# EAGLE design tsop_pcb (EAGLE 9.6.2)
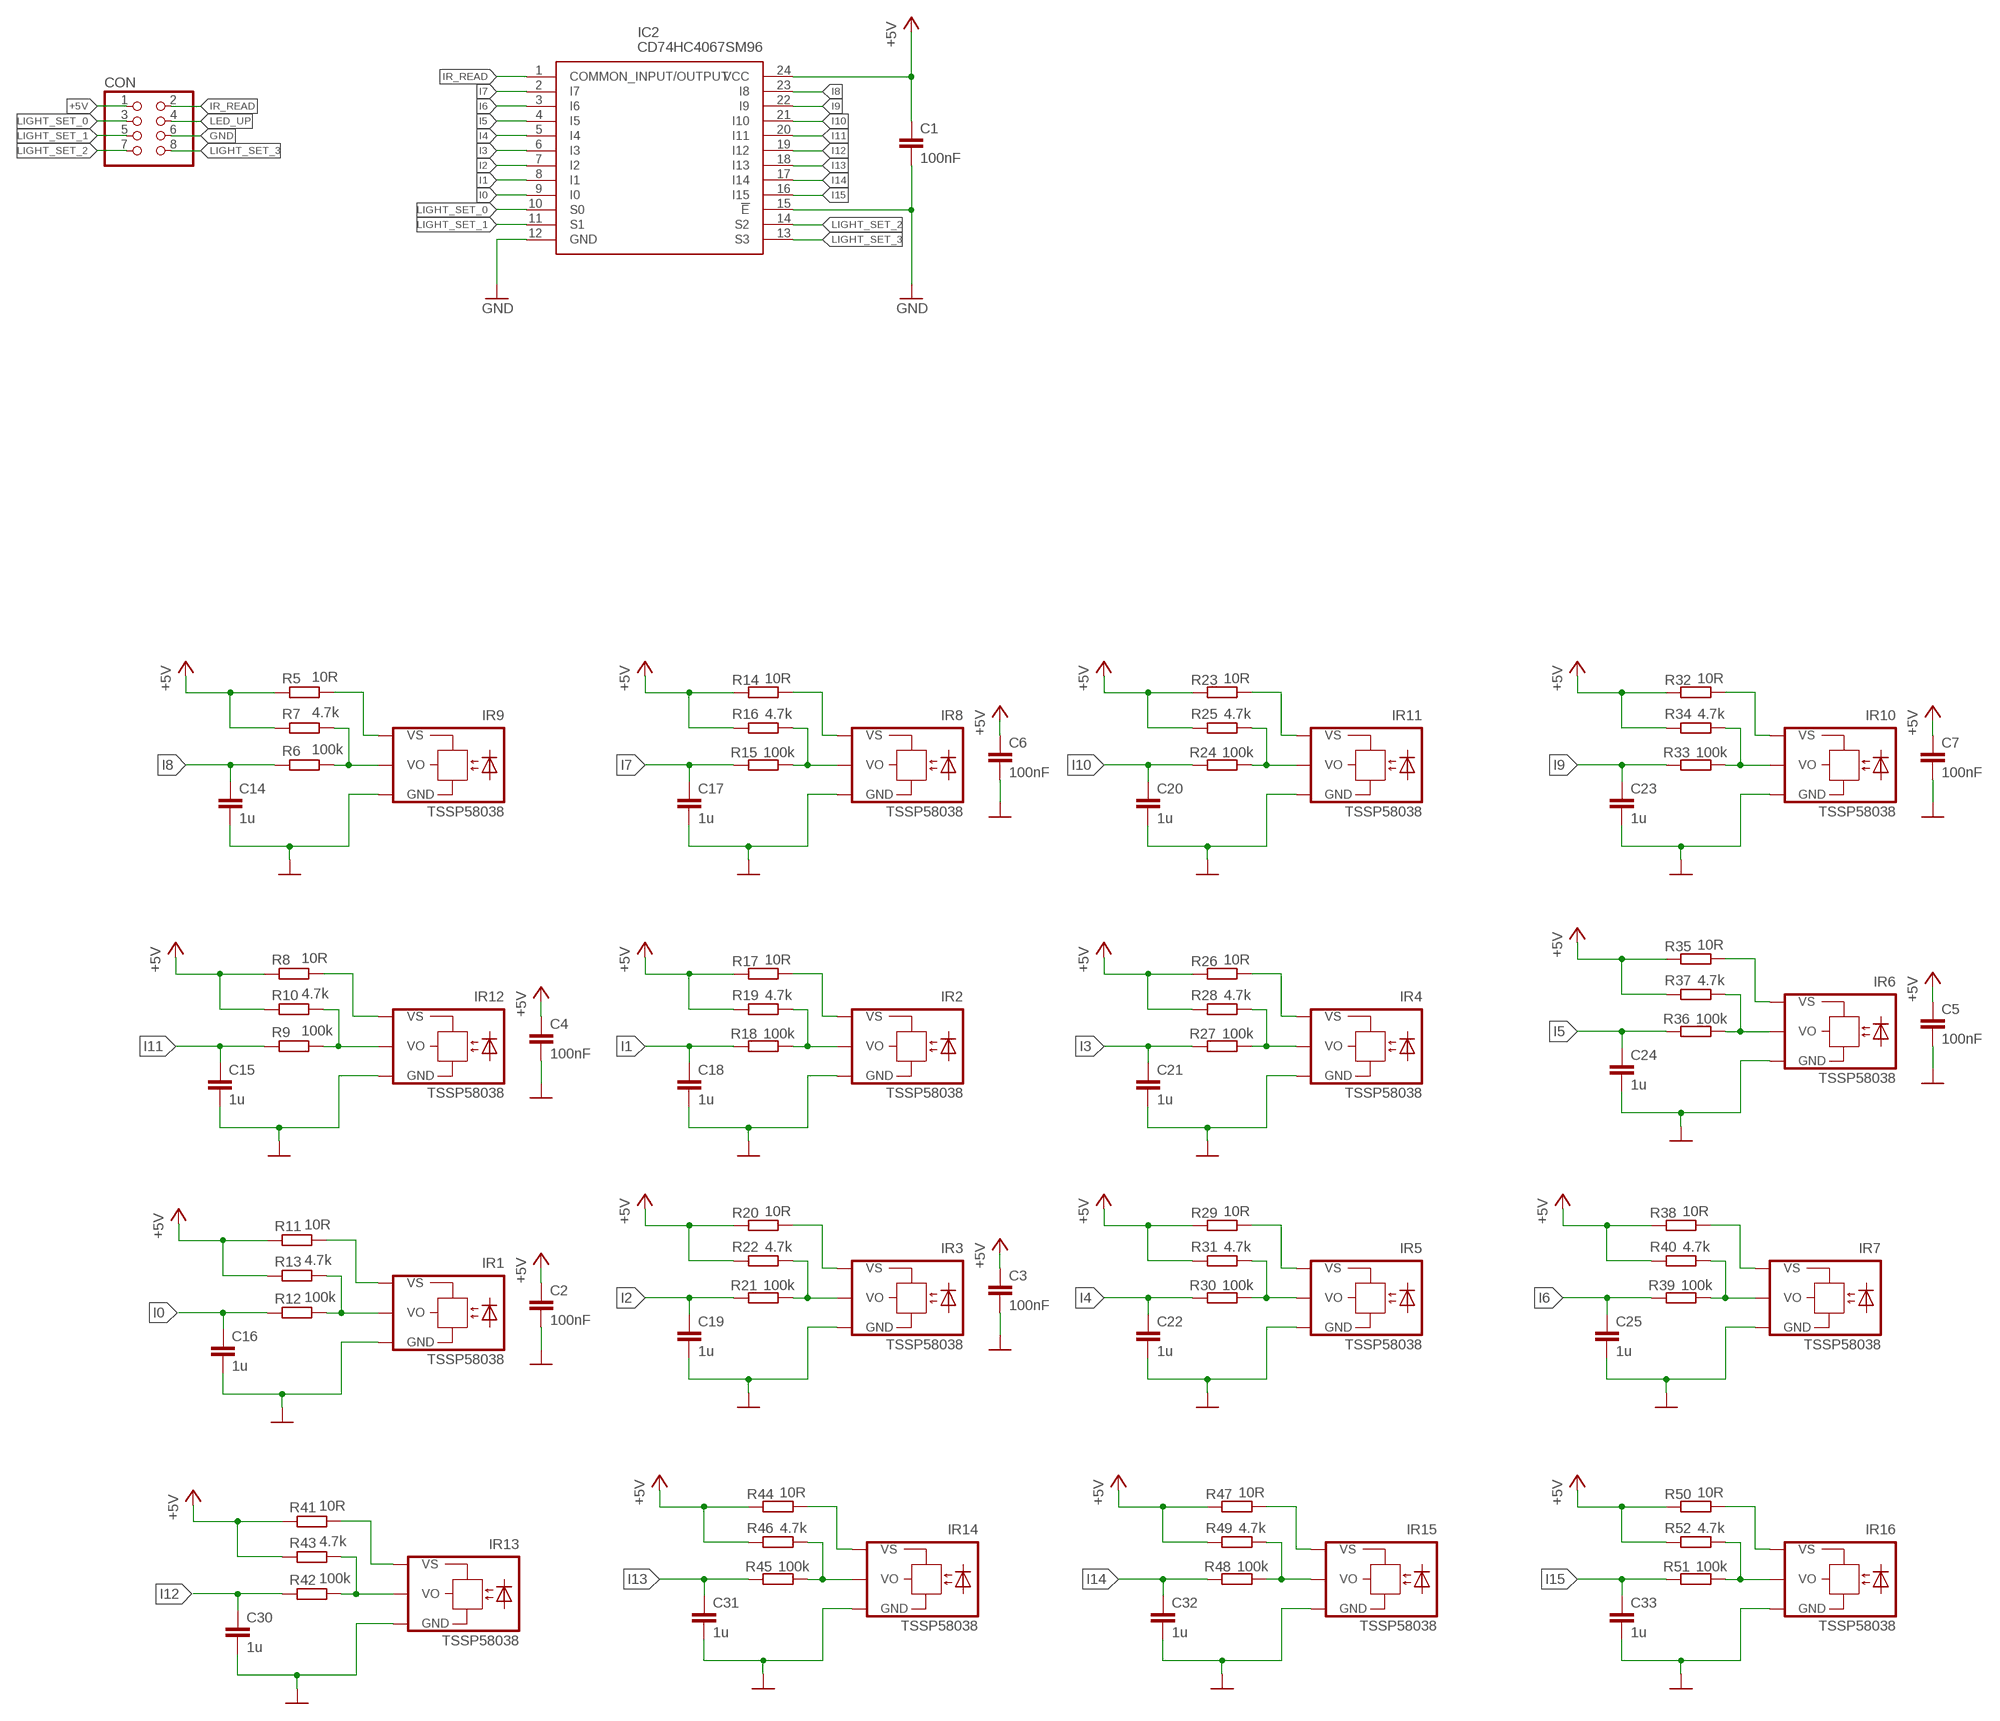
[diagram p0: schematic, sheet 1]

## Parts
C1  100nF  C-EUC0805  [C0805]
C2  100nF  C-EUC0805  [C0805]
C3  100nF  C-EUC0805  [C0805]
C4  100nF  C-EUC0805  [C0805]
C5  100nF  C-EUC0805  [C0805]
C6  100nF  C-EUC0805  [C0805]
C7  100nF  C-EUC0805  [C0805]
C14  1u  C-EUC0805  [C0805]
C15  1u  C-EUC0805  [C0805]
C16  1u  C-EUC0805  [C0805]
C17  1u  C-EUC0805  [C0805]
C18  1u  C-EUC0805  [C0805]
C19  1u  C-EUC0805  [C0805]
C20  1u  C-EUC0805  [C0805]
C21  1u  C-EUC0805  [C0805]
C22  1u  C-EUC0805  [C0805]
C23  1u  C-EUC0805  [C0805]
C24  1u  C-EUC0805  [C0805]
C25  1u  C-EUC0805  [C0805]
C30  1u  C-EUC0805  [C0805]
C31  1u  C-EUC0805  [C0805]
C32  1u  C-EUC0805  [C0805]
C33  1u  C-EUC0805  [C0805]
CON  PINHD-2X4  [2X04]
IC2  CD74HC4067SM96  [SOP65P780X200-24N]
IR1  TSSP58038  TSOP4038  [TSOP]
IR2  TSSP58038  TSOP4038  [TSOP]
IR3  TSSP58038  TSOP4038  [TSOP]
IR4  TSSP58038  TSOP4038  [TSOP]
IR5  TSSP58038  TSOP4038  [TSOP]
IR6  TSSP58038  TSOP4038  [TSOP]
IR7  TSSP58038  TSOP4038  [TSOP]
IR8  TSSP58038  TSOP4038  [TSOP]
IR9  TSSP58038  TSOP4038  [TSOP]
IR10  TSSP58038  TSOP4038  [TSOP]
IR11  TSSP58038  TSOP4038  [TSOP]
IR12  TSSP58038  TSOP4038  [TSOP]
IR13  TSSP58038  TSOP4038  [TSOP]
IR14  TSSP58038  TSOP4038  [TSOP]
IR15  TSSP58038  TSOP4038  [TSOP]
IR16  TSSP58038  TSOP4038  [TSOP]
R5  10R  R-EU_R0805  [R0805]
R6  100k  R-EU_R0805  [R0805]
R7  4.7k  R-EU_R0805  [R0805]
R8  10R  R-EU_R0805  [R0805]
R9  100k  R-EU_R0805  [R0805]
R10  4.7k  R-EU_R0805  [R0805]
R11  10R  R-EU_R0805  [R0805]
R12  100k  R-EU_R0805  [R0805]
R13  4.7k  R-EU_R0805  [R0805]
R14  10R  R-EU_R0805  [R0805]
R15  100k  R-EU_R0805  [R0805]
R16  4.7k  R-EU_R0805  [R0805]
R17  10R  R-EU_R0805  [R0805]
R18  100k  R-EU_R0805  [R0805]
R19  4.7k  R-EU_R0805  [R0805]
R20  10R  R-EU_R0805  [R0805]
R21  100k  R-EU_R0805  [R0805]
R22  4.7k  R-EU_R0805  [R0805]
R23  10R  R-EU_R0805  [R0805]
R24  100k  R-EU_R0805  [R0805]
R25  4.7k  R-EU_R0805  [R0805]
R26  10R  R-EU_R0805  [R0805]
R27  100k  R-EU_R0805  [R0805]
R28  4.7k  R-EU_R0805  [R0805]
R29  10R  R-EU_R0805  [R0805]
R30  100k  R-EU_R0805  [R0805]
R31  4.7k  R-EU_R0805  [R0805]
R32  10R  R-EU_R0805  [R0805]
R33  100k  R-EU_R0805  [R0805]
R34  4.7k  R-EU_R0805  [R0805]
R35  10R  R-EU_R0805  [R0805]
R36  100k  R-EU_R0805  [R0805]
R37  4.7k  R-EU_R0805  [R0805]
R38  10R  R-EU_R0805  [R0805]
R39  100k  R-EU_R0805  [R0805]
R40  4.7k  R-EU_R0805  [R0805]
R41  10R  R-EU_R0805  [R0805]
R42  100k  R-EU_R0805  [R0805]
R43  4.7k  R-EU_R0805  [R0805]
R44  10R  R-EU_R0805  [R0805]
R45  100k  R-EU_R0805  [R0805]
R46  4.7k  R-EU_R0805  [R0805]
R47  10R  R-EU_R0805  [R0805]
R48  100k  R-EU_R0805  [R0805]
R49  4.7k  R-EU_R0805  [R0805]
R50  10R  R-EU_R0805  [R0805]
R51  100k  R-EU_R0805  [R0805]
R52  4.7k  R-EU_R0805  [R0805]

## Nets
+5V: C1.1 C2.1 C3.1 C4.1 C5.1 C6.1 C7.1 CON.1 IC2.24(VCC) R5.1 R7.1 R8.1 R10.1 R11.1 R13.1 R14.1 R16.1 R17.1 R19.1 R20.1 R22.1 R23.1 R25.1 R26.1 R28.1 R29.1 R31.1 R32.1 R34.1 R35.1 R37.1 R38.1 R40.1 R41.1 R43.1 R44.1 R46.1 R47.1 R49.1 R50.1 R52.1
GND: C1.2 C2.2 C3.2 C4.2 C5.2 C6.2 C7.2 C14.2 C15.2 C16.2 C17.2 C18.2 C19.2 C20.2 C21.2 C22.2 C23.2 C24.2 C25.2 C30.2 C31.2 C32.2 C33.2 CON.6 IC2.12(GND) IC2.15(!E) IR1.GND IR2.GND IR3.GND IR4.GND IR5.GND IR6.GND IR7.GND IR8.GND IR9.GND IR10.GND IR11.GND IR12.GND IR13.GND IR14.GND IR15.GND IR16.GND
I0: C16.1 IC2.9(I0) R12.1
I1: C18.1 IC2.8(I1) R18.1
I2: C19.1 IC2.7(I2) R21.1
I3: C21.1 IC2.6(I3) R27.1
I4: C22.1 IC2.5(I4) R30.1
I5: C24.1 IC2.4(I5) R36.1
I6: C25.1 IC2.3(I6) R39.1
I7: C17.1 IC2.2(I7) R15.1
I8: C14.1 IC2.23(I8) R6.1
I9: C23.1 IC2.22(I9) R33.1
I10: C20.1 IC2.21(I10) R24.1
I11: C15.1 IC2.20(I11) R9.1
I12: C30.1 IC2.19(I12) R42.1
I13: C31.1 IC2.18(I13) R45.1
I14: C32.1 IC2.17(I14) R48.1
I15: C33.1 IC2.16(I15) R51.1
IR_READ: CON.2 IC2.1(COMMON_INPUT/OUTPUT)
LED_UP: CON.4
LIGHT_SET_0: CON.3 IC2.10(S0)
LIGHT_SET_1: CON.5 IC2.11(S1)
LIGHT_SET_2: CON.7 IC2.14(S2)
LIGHT_SET_3: CON.8 IC2.13(S3)
N$8: IR12.VS R8.2
N$9: IR1.VS R11.2
N$10: IR8.VS R14.2
N$11: IR2.VS R17.2
N$12: IR3.VS R20.2
N$13: IR11.VS R23.2
N$14: IR4.VS R26.2
N$15: IR5.VS R29.2
N$16: IR10.VS R32.2
N$17: IR9.VS R5.2
N$18: IR6.VS R35.2
N$19: IR7.VS R38.2
N$20: IR12.VO R9.2 R10.2
N$21: IR9.VO R6.2 R7.2
N$22: IR5.VO R30.2 R31.2
N$23: IR1.VO R12.2 R13.2
N$24: IR13.VS R41.2
N$25: IR8.VO R15.2 R16.2
N$26: IR4.VO R27.2 R28.2
N$27: IR2.VO R18.2 R19.2
N$28: IR14.VS R44.2
N$29: IR11.VO R24.2 R25.2
N$30: IR3.VO R21.2 R22.2
N$31: IR15.VS R47.2
N$32: IR10.VO R33.2 R34.2
N$33: IR16.VS R50.2
N$34: IR6.VO R36.2 R37.2
N$35: IR13.VO R42.2 R43.2
N$36: IR7.VO R39.2 R40.2
N$37: IR14.VO R45.2 R46.2
N$38: IR15.VO R48.2 R49.2
N$39: IR16.VO R51.2 R52.2

## Library data of the parts
C1-C7 C14-C25 C30-C33 = rcl:C-EU: CAPACITOR, European symbol; SPICEPREFIX: C
CON = pinhead:PINHD-2X4: PIN HEADER
IC2 = SamacSys_Parts:CD74HC4067SM96: High Speed CMOS 16-Ch MUX/DEMUX 24P SOIC CD74HC4067SM96, Multiplexer/Demultiplexer Single 16:1, 3 V, 5 V, 24-Pin, SSOP, 1 Source: Datasheet <https://datasheet.datasheetarchive.com/originals/distributors/SFDatasheet-6/sf-000127204.pdf>; DESCRIPTION: High Speed CMOS 16-Ch MUX/DEMUX 24P SOIC CD74HC4067SM96, Multiplexer/Demultiplexer Single 16:1, 3 V, 5 V, 24-Pin, SSOP, 1; HEIGHT: 2mm; MANUFACTURER_NAME: Texas Instruments; MANUFACTURER_PART_NUMBER: CD74HC4067SM96; MOUSER_PART_NUMBER: 595-CD74HC4067SM96; MOUSER_PRICE-STOCK: https://www.mouser.co.uk/ProductDetail/Texas-Instruments/CD74HC4067SM96?qs=JHHQeKcAU3DyfvAOSRLjhQ%3D%3D
IR1-IR16 = TSOP4038:TSOP4038: TSOP4038 IR Receiver Module Source: http://www.vishay.com/docs/81926/tsop4038.pdf Check availability <https://pricing.snapeda.com/parts/TSOP4038/Vishay/view-part?ref=eda>; AVAILABILITY: In Stock; DESCRIPTION: Remote Receiver Sensor, 38.0kHz 30m Through Hole; MF: Vishay; MP: TSOP4038; PACKAGE: None; PRICE: None; PURCHASE-URL: https://pricing.snapeda.com/search/part/TSOP4038/?ref=eda
R5-R52 = rcl:R-EU_: RESISTOR, European symbol; SPICEPREFIX: R

## Net classes
0 default: clearance 0.205 mm

## Board
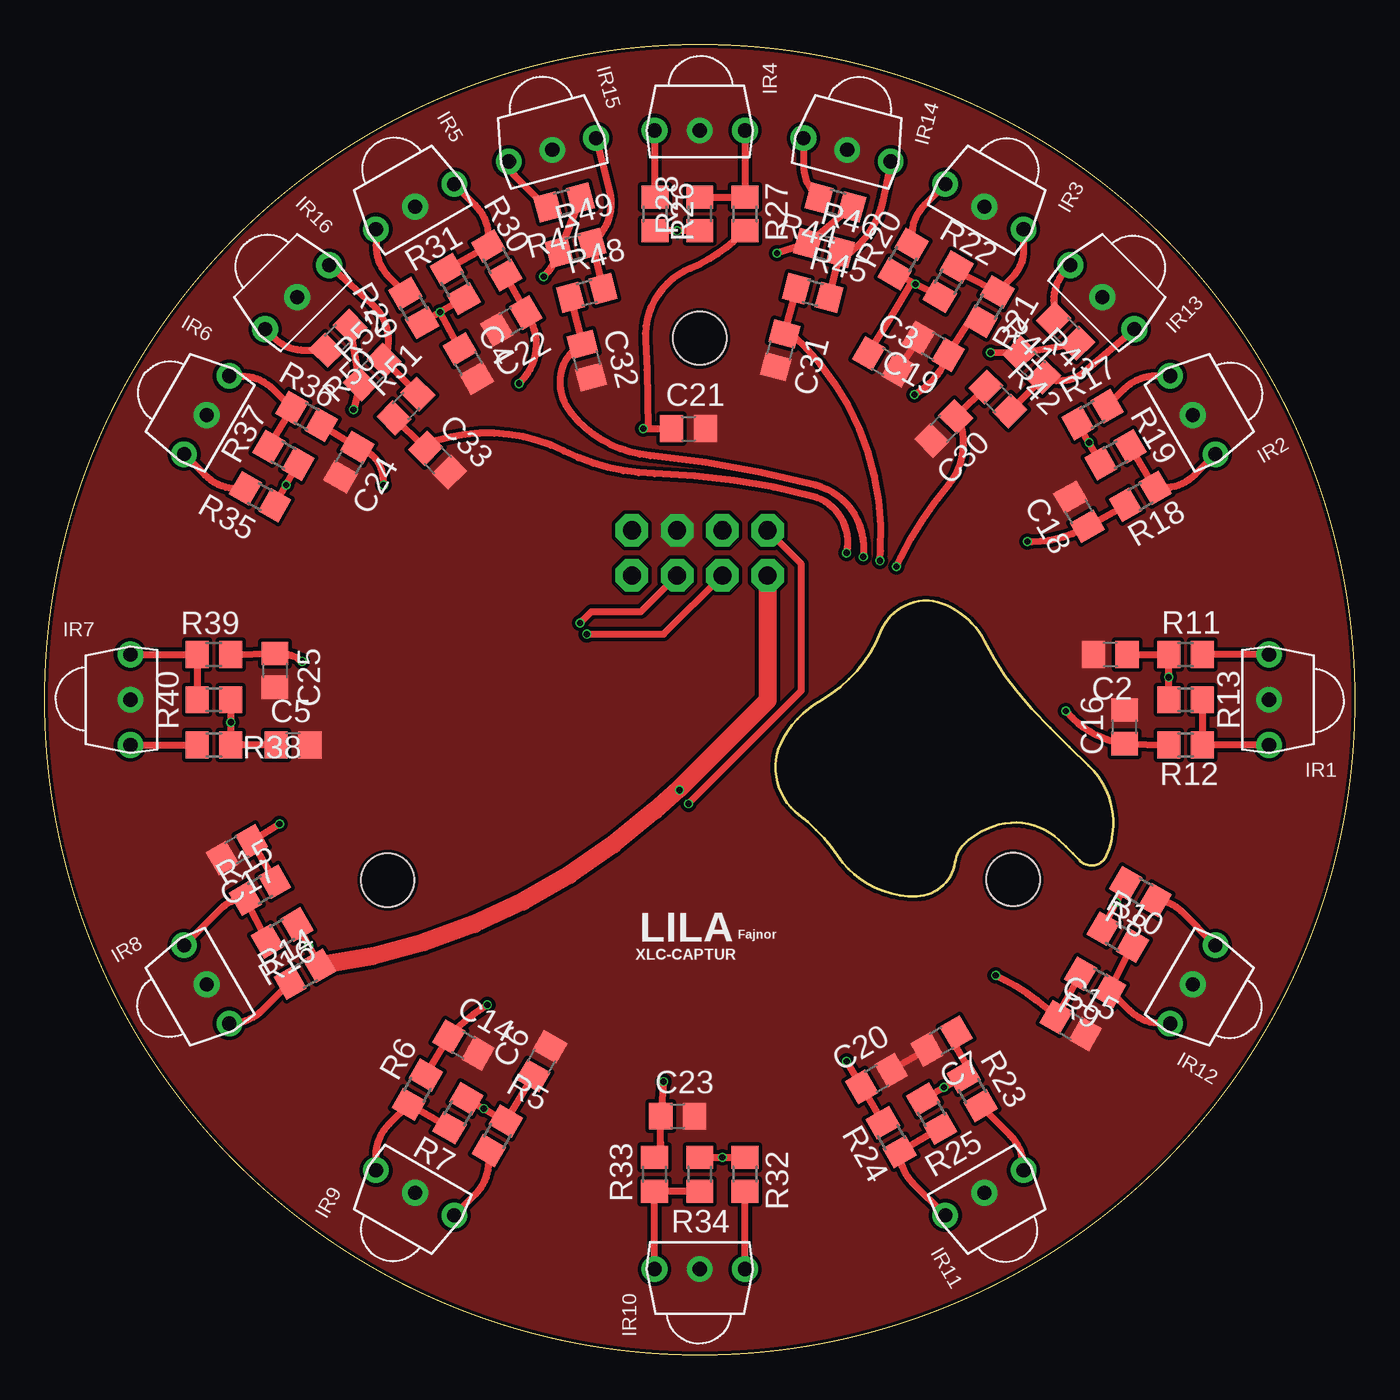
[diagram p1: board, top side]
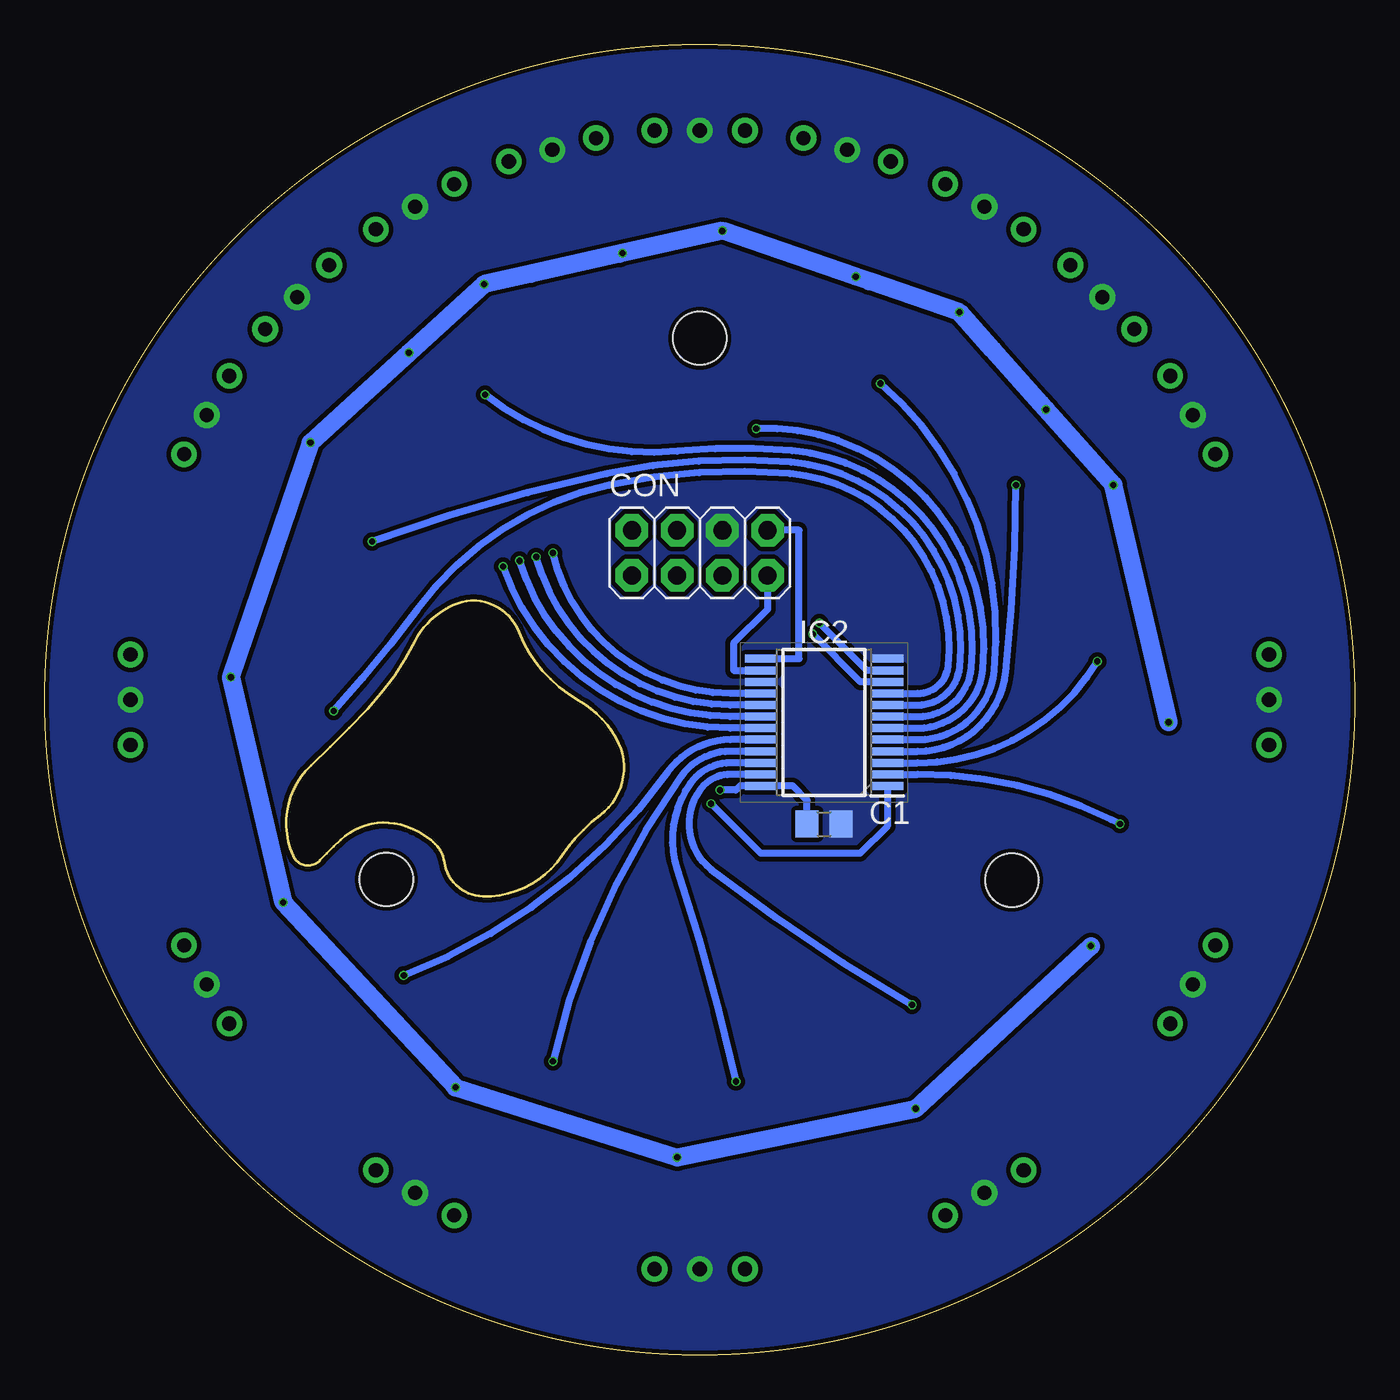
[diagram p2: board, bottom side, seen from below]

Size 73.66 x 73.66 mm. Coordinates in mm from the lower left corner, seen from the top.
Outline: 51.94,28.96 arc44 51.18,27.69 arc-80 49.02,25.78 arc-58 44.58,28.07 arc19 42.42,30.35 arc-82 41.53,34.67 arc-31 43.69,36.83 arc39 46.99,40.64 arc-98 50.93,42.04 arc-8 51.69,41.53 arc-26 52.83,40.13 arc17 55.5,36.32 arc3 58.67,33.15 arc-70 59.69,28.07 arc-113 58.17,27.81 arc5 57.02,28.96 arc62 53.34,29.72 arc17 51.94,28.96
Outline: circle at 36.83,36.83 radius 36.83
Copper layers (1*16): Top 0.035mm / dielectric 1.6mm / Bottom 0.035mm
Design rules "tsop_PCB_V1": minimum track width 5mil, minimum drill 0.3mm, track to track 0.205mm, track to pad 0.205mm, pad to pad 0.205mm, via to via 0.205mm, smd to smd 5mil, copper to edge 0.2mm, drill to drill 6mil, minimum pad ring 10mil, minimum via ring 3mil, stop-mask expansion 4mil, vias tented up to drill 0mil, thermal gap 10mil
Holes 3 mm at 36.83,57.15 54.44,26.73 19.29,26.69

### Footprints (pad centres in the part's own frame; a part is rotated, then mirrored left to right if it is on the bottom)
C0805 = smd 1.3 x 1.5: 1 -0.95,0; 2 0.95,0
2X04 = drill 1.016 octagon: 1 -3.81,-1.27; 2 -3.81,1.27; 3 -1.27,-1.27; 4 -1.27,1.27; 5 1.27,-1.27; 6 1.27,1.27; 7 3.81,-1.27; 8 3.81,1.27
SOP65P780X200-24N = smd 1.8 x 0.45: 1 -3.55,3.575; 2 -3.55,2.925; 3 -3.55,2.275; 4 -3.55,1.625; 5 -3.55,0.975; 6 -3.55,0.325; 7 -3.55,-0.325; 8 -3.55,-0.975; 9 -3.55,-1.625; 10 -3.55,-2.275; 11 -3.55,-2.925; 12 -3.55,-3.575; 13 3.55,-3.575; 14 3.55,-2.925; 15 3.55,-2.275; 16 3.55,-1.625; 17 3.55,-0.975; 18 3.55,-0.325; 19 3.55,0.325; 20 3.55,0.975; 21 3.55,1.625; 22 3.55,2.275; 23 3.55,2.925; 24 3.55,3.575
TSOP = drill 0.8: GND 0,0; VO 0,-2.54; VS 0,2.54
R0805 = smd 1.3 x 1.5: 1 -0.95,0; 2 0.95,0

### Placement (x,y rotation side)
C1  29.84,29.84 0 bottom
C2  59.9,39.37 180 top
C3  47.14,55.83 330 top
C4  23.82,55.73 300 top
C5  13.97,34.29 0 top
C6  27.94,16.51 60 top
C7  50.42,17.65 210 top
C14  23.55,17.42 330 top
C15  57.68,18.52 330 top
C16  60.71,35.31 90 top
C17  10.82,28.4 210 top
C18  58.14,47.4 120 top
C19  49.96,56.69 150 top
C20  46.76,15.54 30 top
C21  36.2,52.07 0 top
C22  26.24,58.12 210 top
C23  35.59,13.44 0 top
C24  17.12,50.19 240 top
C25  12.95,38.48 270 top
C30  50.55,52.07 225 top
C31  41.34,56.47 255 top
C32  30.48,55.88 285 top
C33  22.1,50.29 315 top
CON  36.83,45.09 0 bottom
IC2  29.84,35.56 180 bottom
IR1  68.83,36.83 0 top
IR2  64.54,52.83 30 top
IR3  52.83,64.54 60 top
IR4  36.83,68.83 90 top
IR5  20.83,64.54 120 top
IR6  9.12,52.83 150 top
IR7  4.83,36.83 180 top
IR8  9.12,20.83 210 top
IR9  20.83,9.12 240 top
IR10  36.83,4.83 270 top
IR11  52.83,9.12 300 top
IR12  64.54,20.83 330 top
IR13  59.46,59.46 45 top
IR14  45.11,67.74 75 top
IR15  28.55,67.74 105 top
IR16  14.2,59.46 135 top
R5  25.45,12.32 240 top
R6  20.95,14.91 240 top
R7  23.24,13.59 240 top
R8  61.59,26.03 330 top
R9  59.05,20.95 330 top
R10  60.33,23.49 330 top
R11  64.13,39.37 0 top
R12  64.13,34.29 0 top
R13  64.13,36.83 0 top
R14  14.63,21.41 210 top
R15  12.12,26.14 210 top
R16  13.36,23.72 210 top
R17  58.9,52.86 30 top
R18  61.59,48.26 30 top
R19  60.2,50.6 30 top
R20  48.26,61.59 60 top
R21  53.09,58.93 60 top
R22  50.8,60.33 60 top
R23  52.15,14.83 300 top
R24  47.6,12.24 300 top
R25  49.86,13.56 300 top
R26  34.32,64.13 90 top
R27  39.37,64.13 90 top
R28  36.83,64.13 90 top
R29  20.75,58.85 120 top
R30  25.43,61.52 120 top
R31  23.09,60.2 120 top
R32  39.37,10.16 270 top
R33  34.29,10.16 270 top
R34  36.83,10.16 270 top
R35  12.12,48.23 150 top
R36  14.73,52.76 150 top
R37  13.44,50.57 150 top
R38  9.52,34.29 180 top
R39  9.52,39.37 180 top
R40  9.52,36.83 180 top
R41  57.39,57.54 135 top
R42  53.58,53.73 315 top
R43  55.49,55.64 315 top
R44  44.45,64.77 165 top
R45  43.18,59.69 345 top
R46  43.81,62.23 345 top
R47  29.21,64.77 195 top
R48  30.48,59.69 15 top
R49  29.84,62.23 15 top
R50  16.51,57.15 225 top
R51  20.32,53.34 45 top
R52  18.41,55.24 45 top

### Tracks (layer width: path | path; a pad name or v marks a point on that pad's centre or on a via)
+5V  (via drill 0.35)
  Top 0.406: R34.1 v38.1,11.11 R32.1 | R25.1 v50.56,15.04 R23.1 52.07,15.88 51.18,17.4 C7.1 | R13.1 v63.19,38.1 R11.1 C2.1 | R10.1 v60.24,25.44 R8.1 | R19.1 v58.71,51.28 R17.1 | R22.1 v48.95,60.19 48.75,60.29 | 48.75,60.29 R20.1 | R28.1 v35.56,63.19 R26.1 | R47.1 R49.1 arc-21 v28.06,60.61 | R31.1 v22.24,58.61 | v22.24,58.61 R29.1 | R35.1 v13.58,48.9 R37.1 | R40.1 v10.47,35.56 R38.1 C5.1 | 14.43,23.95 R16.1 v14.85,22.99 R14.1 | R7.1 v24.7,13.85 R5.1 C6.1 | C3.1 47.62,58.42 48.75,60.29 | C4.1 v22.24,58.61 | R41.1 R43.1 v53.17,56.33 | R44.1 R46.1 v41.17,61.93 | R50.1 R52.1 v17.37,53.14 | v35.69,31.75 35.89,32.05
  Top 1.016: 35.89,32.05 40.64,36.8 CON.1 | 35.89,32.05 35.64,31.8 | 35.89,32.05 34.29,30.61 arc-34 R14.1
  Bottom 0.406: C1.1 30.79,31.18 31.6,31.98 IC2.24 34.56,31.98 34.8,31.75 v35.69,31.75 | v41.17,61.93 41.34,61.89
  Bottom 1.016: v10.47,35.56 v13.58,48.9 v17.37,53.14 17.65,53.46 20.35,56.49 v22.24,58.61 27.3,60.35 v28.06,60.61 v35.56,63.19 41.34,61.89 46.31,60.78 v48.95,60.19 v53.17,56.33 v58.71,51.28 v63.19,38.1 v60.24,25.44 v50.56,15.04 v38.1,11.11 v24.7,13.85 v14.85,22.99
GND
  Top 0.406: C19.2 C3.2 | C20.2 C7.2
  pour Top (no thermals): -8.26,-10.16 -8.26,81.28 80.01,81.28 80.01,-10.16
  pour Bottom (isolate 0.254, no thermals): -8.26,81.28 80.01,81.28 80.01,-10.16 -8.26,-10.16
I0  (via drill 0.35)
  Top 0.406: R12.1 C16.1 arc-37 57.78,35.81 v57.4,36.2
  Bottom 0.406: IC2.9 24.58,37.18 arc-84 22.86,38.73 arc-91 31.75,49.53 arc-17 41.91,48.89 arc-41 52.7,41.91 arc6 v57.4,36.2
I1  (via drill 0.35)
  Top 0.406: R18.1 C18.1 arc-31 55.5,45.72 v55.24,45.72
  Bottom 0.406: IC2.8 24.58,36.53 arc-84 22.21,38.67 arc-91 31.69,50.18 arc-17 42.05,49.53 arc-8 v55.24,45.72
I2  (via drill 0.35)
  Top 0.406: R21.1 51.94,58.04 C19.1 arc-38 49.28,54.23 v48.89,53.97
  Bottom 0.406: IC2.7 24.58,35.88 arc-84 21.57,38.6 arc-91 31.64,50.82 arc-11 38.1,50.8 arc44 v48.89,53.97
I3  (via drill 0.35)
  Top 0.406: v33.66,52.07 33.91,52.07 | 33.91,52.07 C21.1 | R27.1 38.73,62.61 arc-20 36.32,61.09 arc71 33.78,57.02 arc-4 33.91,52.07
  Bottom 0.406: IC2.6 24.58,35.23 arc-84 20.92,38.53 arc-99 v33.66,52.07
I4  (via drill 0.35)
  Top 0.406: R30.1 C22.1 arc-82 26.8,54.74 v26.67,54.61
  Bottom 0.406: IC2.5 24.58,34.59 arc-84 20.27,38.46 arc-55 v26.67,54.61
I5  (via drill 0.35)
  Top 0.406: R36.1 C24.1 arc-76 19.05,49.15 v19.05,48.89
  Bottom 0.406: IC2.4 24.58,33.93 arc-84 19.63,38.39 arc-6 v19.05,48.89
I6  (via drill 0.35)
  Top 0.406: C25.1 12.95,39.38 12.95,39.37 | R39.1 C25.1 | C25.1 13.59,39.37 arc-35 v14.48,38.99
  Bottom 0.406: IC2.3 24.58,33.28 arc-59 v14.48,38.99
I7  (via drill 0.35)
  Top 0.406: 12.94,26.93 12.94,26.67 | 12.94,26.67 R15.1 | 12.94,26.67 C17.1 v13.21,29.84
  Bottom 0.406: IC2.2 24.58,32.63 arc27 13.72,30.1 v13.21,29.84
I8  (via drill 0.35)
  Top 0.406: C14.1 22.54,17.59 | 22.54,17.59 R6.1 | v24.89,19.68 24.51,19.43 arc19 22.54,17.59
  Bottom 0.406: IC2.23 35.11,32.63 arc-54 36.83,31.75 arc-87 36.2,27.3 arc-8 v24.89,19.68
I9  (via drill 0.35)
  Top 0.406: R33.1 arc45 34.63,11.94 34.63,13.33 | 34.63,13.33 C23.1 | v34.8,15.37 34.63,13.33
  Bottom 0.406: IC2.22 35.11,33.28 arc-54 37.36,32.13 arc-54 38.1,27.3 arc5 v34.8,15.37
I10  (via drill 0.35)
  Top 0.406: C20.1 46.09,14.82 | 46.09,14.82 R24.1 | v45.09,16.51 46.09,14.82
  Bottom 0.406: IC2.21 35.11,33.93 arc-54 37.89,32.51 arc-23 v45.09,16.51
I11  (via drill 0.35)
  Top 0.406: R9.1 arc-45 58.42,20.98 arc-90 58.23,21.16 R9.1 | R9.1 C15.1 arc19 53.97,21.08 v53.47,21.34
  Bottom 0.406: IC2.20 35.11,34.59 arc-54 38.63,32.77 arc34 v53.47,21.34
I12  (via drill 0.35)
  Top 0.406: v47.88,44.32 48.13,44.83 arc-13 50.8,48.89 arc65 51.31,52.83 | C30.1 51.31,52.83 | 51.31,52.83 R42.1
  Bottom 0.406: IC2.19 35.11,35.23 arc71 v47.88,44.32
I13  (via drill 0.35)
  Top 0.406: 41.66,57.7 41.69,57.83 R45.1 | 41.66,57.7 C31.1 | v46.96,44.64 46.99,45.21 arc53 41.66,57.7
  Bottom 0.406: IC2.18 35.11,35.88 arc73 v46.96,44.64
I14  (via drill 0.35)
  Top 0.406: R48.1 C32.1 arc49 29.08,55.37 arc53 29.59,52.96 arc46 34.04,50.55 arc-9 43.35,48.89 arc-83 v46.02,44.86
  Bottom 0.406: IC2.17 35.11,36.53 arc75 v46.02,44.86
I15  (via drill 0.35)
  Top 0.406: 21.28,51.11 21.28,51.12 arc-49 29.21,50.8 arc25 34.29,49.53 arc-13 43.18,48.26 arc-88 v45.09,45.09 | 21.28,51.11 C33.1 | R51.1 21.28,51.11
  Bottom 0.406: IC2.16 35.11,37.18 arc77 v45.09,45.09
IR_READ  (via drill 0.35)
  Top 0.406: v36.2,30.99 42.55,37.34 42.55,44.45 CON.2
  Bottom 0.406: IC2.1 26.29,29.71 27.81,28.19 33.4,28.19 v36.2,30.99
LIGHT_SET_0  (via drill 0.35)
  Top 0.406: v30.48,40.51 34.8,40.51 CON.3
  Bottom 0.406: IC2.10 27.8,37.84 v30.48,40.51
LIGHT_SET_1  (via drill 0.35)
  Top 0.406: v30.1,41.15 30.73,41.78 33.53,41.78 CON.5
  Bottom 0.406: IC2.11 27.44,38.48 v30.1,41.15
LIGHT_SET_2
  Bottom 0.406: IC2.14 34.92,38.48 34.92,40 33.02,41.91 CON.7
LIGHT_SET_3
  Bottom 0.406: IC2.13 31.24,39.13 31.24,46.35 CON.8
N$8
  Top 0.406: IR12.VS 63.89,24.95 arc45 R8.2
N$9
  Top 0.406: IR1.VS R11.2
N$10
  Top 0.406: IR8.VS arc45 12.29,19.42 R14.2
N$11
  Top 0.406: IR2.VS 62.47,55.03 arc45 60.68,54.29 R17.2
N$12
  Top 0.406: IR3.VS 49.48,64.66 arc45 48.73,62.86 R20.2
N$13
  Top 0.406: IR11.VS 55.03,10.55 arc45 54.29,12.35 R23.2
N$14
  Top 0.406: IR4.VS 34.29,65.15 arc45 R26.2
N$15
  Top 0.406: IR5.VS 18.63,62.37 arc45 19.37,60.58 R29.2
N$16
  Top 0.406: IR10.VS R32.2
N$17
  Top 0.406: IR9.VS 24.23,9.05 arc45 24.98,10.84 R5.2
N$18
  Top 0.406: IR6.VS 9.02,49.45 arc45 10.82,48.71 R35.2
N$19
  Top 0.406: IR7.VS R38.2
N$20
  Top 0.406: IR12.VO 62.78,18.63 arc-45 60.98,19.37 R9.2 R10.2
N$21
  Top 0.406: IR9.VO 18.63,11.18 arc-45 19.37,12.98 R6.2 R7.2
N$22
  Top 0.406: IR5.VO 24.21,64.64 arc-45 24.95,62.84 R30.2 R31.2
N$23
  Top 0.406: IR1.VO R12.2 R13.2
N$24
  Top 0.406: IR13.VS 57.47,61.06 arc45 56.72,59.26 R41.2
N$25
  Top 0.406: IR8.VO 9.9,25.09 arc-45 R15.2 R16.2
N$26
  Top 0.406: IR4.VO R27.2 R28.2
N$27
  Top 0.406: IR2.VO 64.66,49.48 arc-45 62.86,48.73 R18.2 R19.2
N$28
  Top 0.406: IR14.VS 42.66,66.94 arc45 43.4,65.15 R44.2
N$29
  Top 0.406: IR11.VO 48.79,9.68 arc-45 R24.2 R25.2
N$30
  Top 0.406: IR3.VO 55.03,62.14 arc-45 54.38,60.56 R21.2 51.78,60.64 R22.2
N$31
  Top 0.406: IR15.VS arc45 26.42,66.29 28.11,64.6 arc45 R47.2
N$32
  Top 0.406: IR10.VO R33.2 R34.2
N$33
  Top 0.406: IR16.VS 12.85,57.22 arc45 14.64,56.48 R50.2
N$34
  Top 0.406: IR6.VO 11.06,55.03 arc-45 12.85,54.29 R36.2 R37.2
N$35
  Top 0.406: R42.2 R43.2 arc67 58.42,55.24 IR13.VO
N$36
  Top 0.406: IR7.VO R39.2 R40.2
N$37
  Top 0.406: R45.2 44.62,61.55 | 44.62,61.55 R46.2 | IR14.VO 47.12,64.9 arc-50 44.62,61.55
N$38
  Top 0.406: R48.2 R49.2 arc65 31.75,65.41 IR15.VO
N$39
  Top 0.406: IR16.VO 18.41,59.05 arc-71 R52.2 R51.2

### Text on the board
tNames: LILA | Fajnor | XLC-CAPTUR